# Altium schematic sheet 12 HEADERS.SchDoc
size 513 x 386 mm
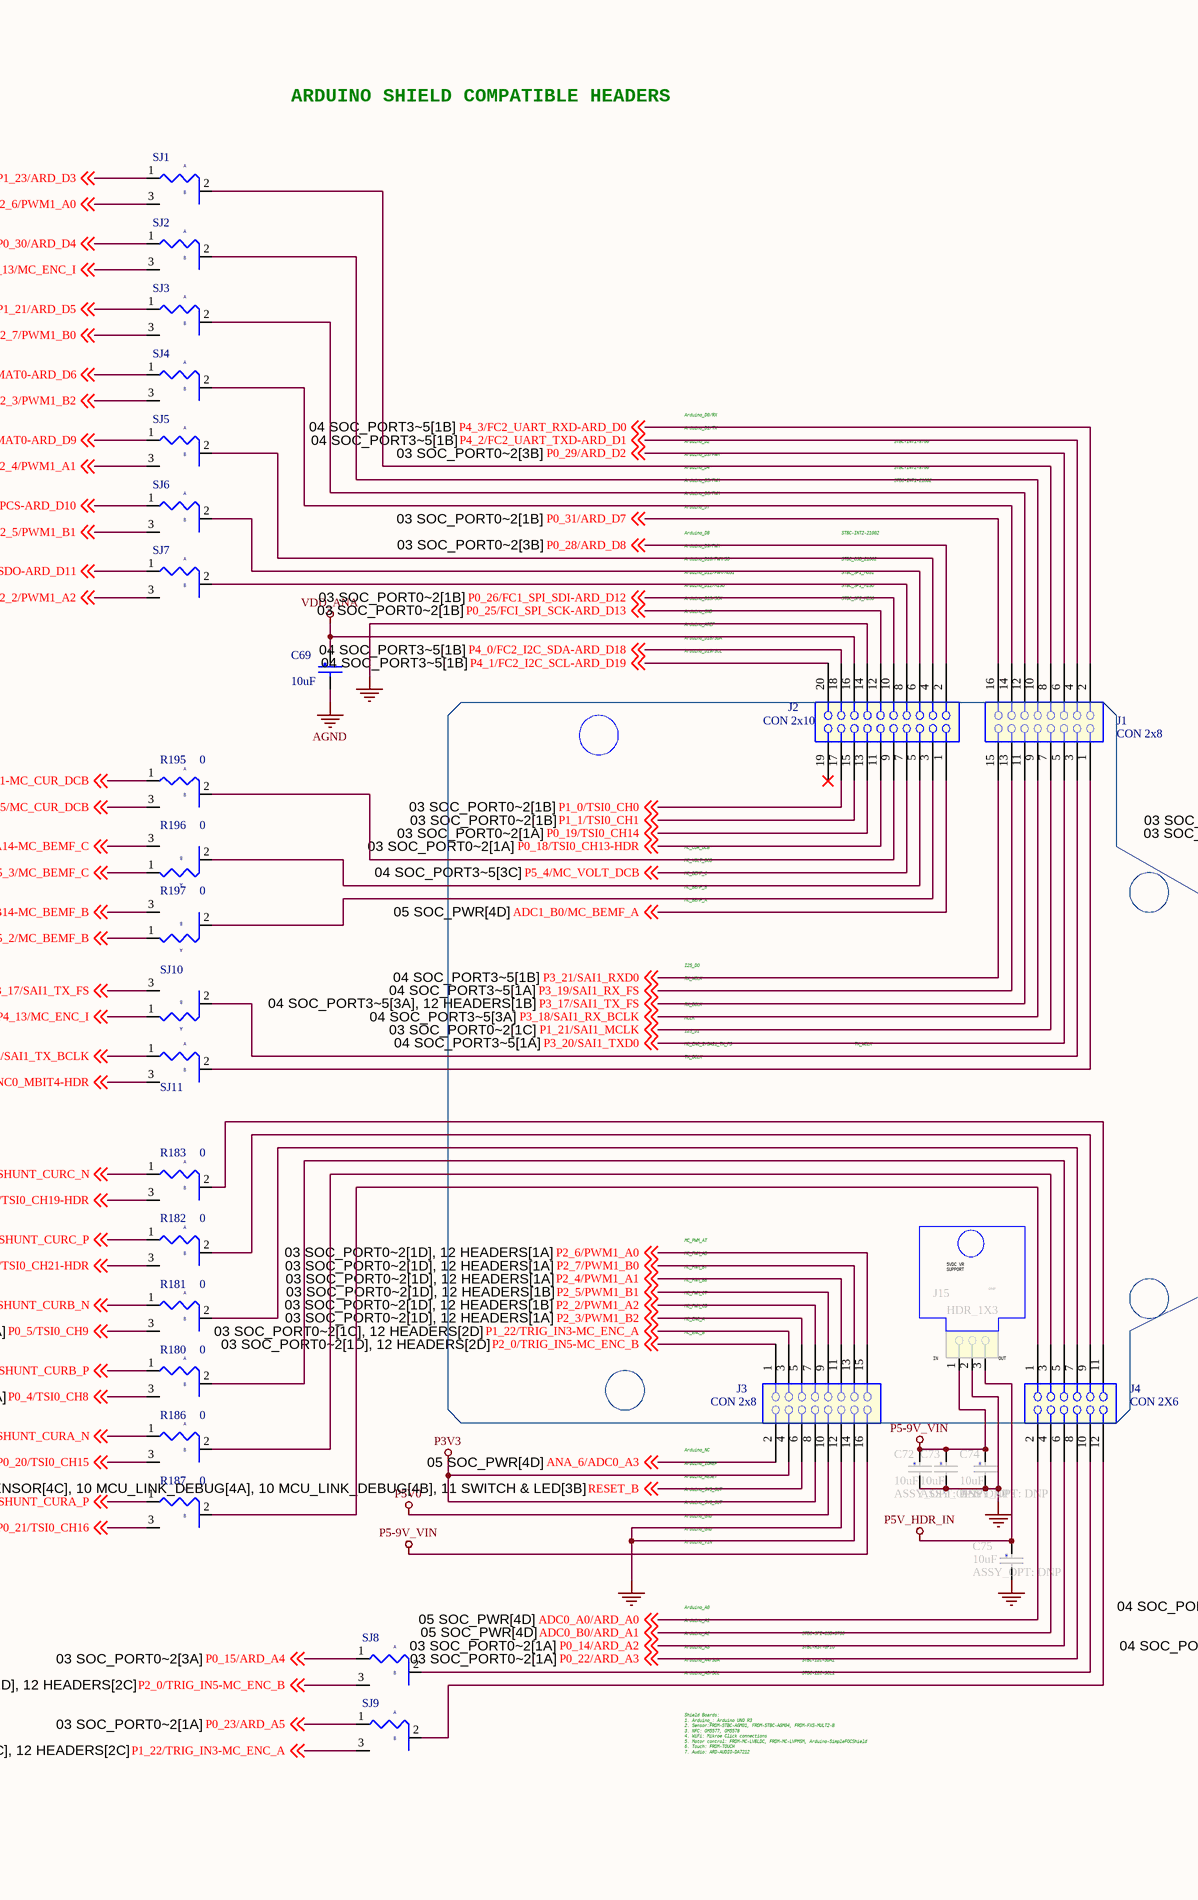
[diagram p0: 12 HEADERS.SchDoc, left]
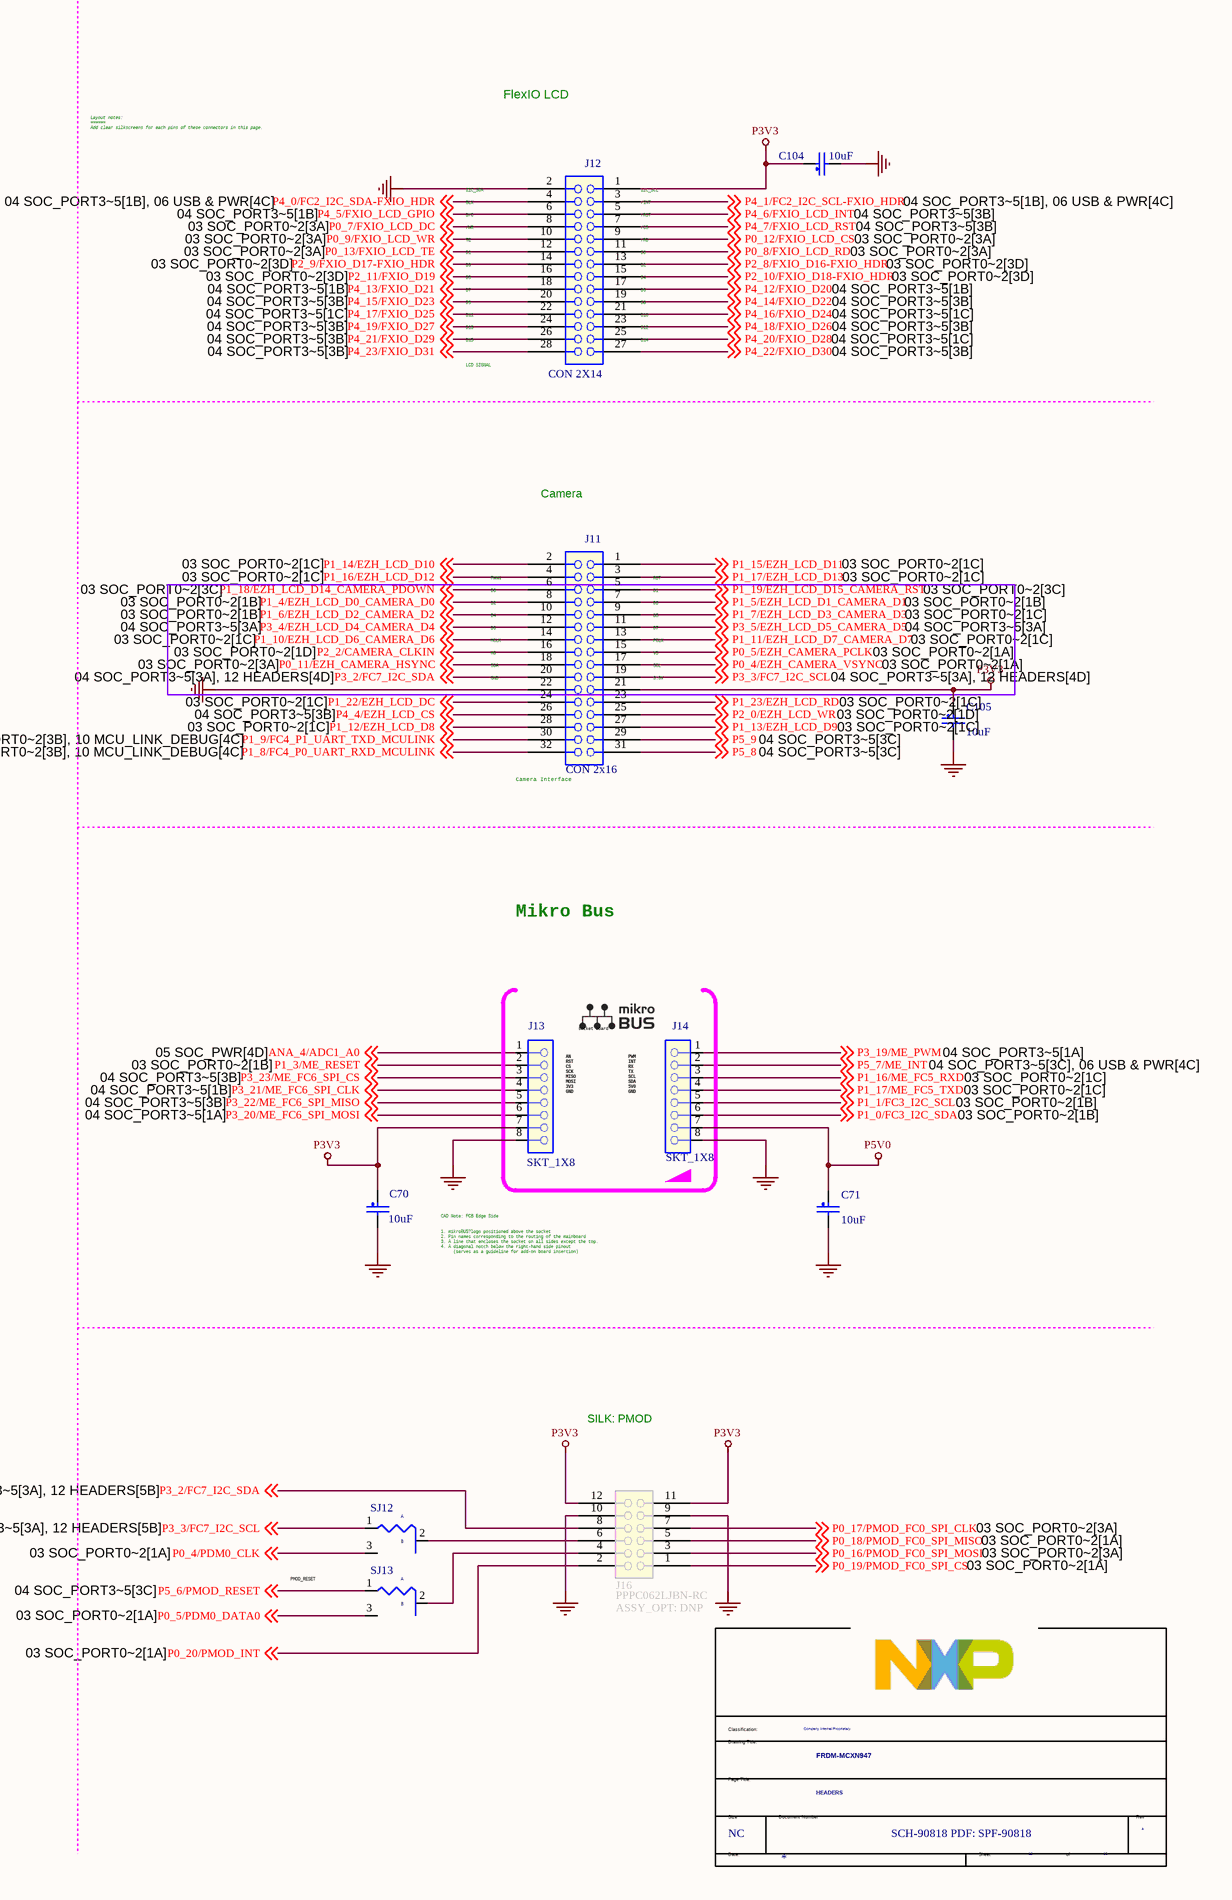
[diagram p1: 12 HEADERS.SchDoc, right]

## Parts
*  Doc: SCH-90818 PDF: SPF-90818  RevCode: A  Title: FRDM-MCXN947  Page Size: NC  Page Number: 12  Page Count: 13  PageTitle: HEADERS  Classification: Company Internal/Proprietary  (hidden comment: TitleBlock_FS)  (graphical)
C69  10uF  [CC0603_OV]
C70  10uF  [CC0603_OV]
C71  10uF  [CC0603_OV]
C72  10uF  ASSY_OPT: DNP  [CC0603_OV]
C73  10uF  ASSY_OPT: DNP  [CC0603_OV]
C74  10uF  ASSY_OPT: DNP  [CC0603_OV]
C75  10uF  ASSY_OPT: DNP  [CC0603_OV]
C104  10uF  [CC0603_OV]
C105  10uF  [CC0603_OV]
J1  CON 2x8  [con_2x8_skt_100_th]
J2  CON 2x10  [con_skt2x10_th]
J3  CON 2x8  [con_2x8_skt_100_th]
J4  CON 2X6  [con_skt2x6_th_126l]
J11  CON 2x16  SILK: Camera  [con_skt_32f_100_th]
J12  CON 2X14  SILK: FlexIO LCD  [con_skt2x14_th_126l]
J13  SKT_1X8  [con_1x8_skt_2p54_th_126l]
J14  SKT_1X8  [con_1x8_skt_2p54_th_126l]
J15  HDR_1X3  ASSY_OPT: DNP  [HDR103]
J16  PPPC062LJBN-RC  ASSY_OPT: DNP  SILK: PMOD  [skt2x6_100_th_ra]
R180  0  [R603-X2]
R181  0  [R603-X2]
R182  0  [R603-X2]
R183  0  [R603-X2]
R186  0  [R603-X2]
R187  0  [R603-X2]
R195  0  [R603-X2]
R196  0  [R603-X2]
R197  0  [R603-X2]
SJ1  3 PIN 0402 JUMPER  [3pin_0402_solder_blob_jumper_short_psp_a]  (value not drawn)
SJ2  3 PIN 0402 JUMPER  [3pin_0402_solder_blob_jumper_short_psp_a]  (value not drawn)
SJ3  3 PIN 0402 JUMPER  [3pin_0402_solder_blob_jumper_short_psp_a]  (value not drawn)
SJ4  3 PIN 0402 JUMPER  [3pin_0402_solder_blob_jumper_short_psp_a]  (value not drawn)
SJ5  3 PIN 0402 JUMPER  [3pin_0402_solder_blob_jumper_short_psp_a]  (value not drawn)
SJ6  3 PIN 0402 JUMPER  [3pin_0402_solder_blob_jumper_short_psp_a]  (value not drawn)
SJ7  3 PIN 0402 JUMPER  [3pin_0402_solder_blob_jumper_short_psp_a]  (value not drawn)
SJ8  3 PIN 0402 JUMPER  [3pin_0402_solder_blob_jumper_short_psp_a]  (value not drawn)
SJ9  3 PIN 0402 JUMPER  [3pin_0402_solder_blob_jumper_short_psp_a]  (value not drawn)
SJ10  3 PIN 0402 JUMPER  [3pin_0402_solder_blob_jumper_short_psp_a]  (value not drawn)
SJ11  3 PIN 0402 JUMPER  [3pin_0402_solder_blob_jumper_short_psp_a]  (value not drawn)
SJ12  3 PIN 0402 JUMPER  [3pin_0402_solder_blob_jumper_short_psp_a]  (value not drawn)
SJ13  3 PIN 0402 JUMPER  [3pin_0402_solder_blob_jumper_short_psp_a]  (value not drawn)

## Nets
AGND: C69.2
GND: C70.2 C71.2 C72.2 C73.2 C74.2 C75.2 C104.2 C105.2 J2.14 J3.12(B6) J3.14(B7) J11.22(B11) J12.2(B1) J13.8 J14.8 J15.2 J16.9(A5) J16.10(B5)
P3V3: C70.1 C104.1 C105.1 J3.4(B2) J3.8(B4) J11.21(A11) J12.1(A1) J13.7 J16.11(A6) J16.12(B6)
P5-9V_VIN: C72.1 C73.1 C74.1 J3.16(B8) J15.1
P5V0: C71.1 J3.10(B5) J14.7
P5V_HDR_IN: C75.1 J15.3
VDD_ANA: C69.1 J2.16
ADC0_A0/ARD_A0: J4.2(B1) ; off-sheet ADC0_A0/ARD_A0
ADC0_B0/ARD_A1: J4.4(B2) ; off-sheet ADC0_B0/ARD_A1
ADC1_B0/MC_BEMF_A: J2.1 ; off-sheet ADC1_B0/MC_BEMF_A
ANA_4/ADC1_A0: J13.1 ; off-sheet ANA_4/ADC1_A0
ANA_6/ADC0_A3: J3.2(B1) ; off-sheet ANA_6/ADC0_A3
OPAMP0_INN/RSHUNT_CURA_N: R186.1 ; off-sheet OPAMP0_INN/RSHUNT_CURA_N
OPAMP1_INN/RSHUNT_CURB_N: R181.1 ; off-sheet OPAMP1_INN/RSHUNT_CURB_N
OPAMP2_INN/RSHUNT_CURC_N: R183.1 ; off-sheet OPAMP2_INN/RSHUNT_CURC_N
P0_3/CMP1_IN1-MC_CUR_DCB: R195.1 ; off-sheet P0_3/CMP1_IN1-MC_CUR_DCB
P0_4/EZH_CAMERA_VSYNC: J11.17(A9) ; off-sheet P0_4/EZH_CAMERA_VSYNC
P0_4/PDM0_CLK: SJ12.3 ; off-sheet P0_4/PDM0_CLK
P0_4/TSI0_CH8: R180.3 ; off-sheet P0_4/TSI0_CH8
P0_5/EZH_CAMERA_PCLK: J11.15(A8) ; off-sheet P0_5/EZH_CAMERA_PCLK
P0_5/PDM0_DATA0: SJ13.3 ; off-sheet P0_5/PDM0_DATA0
P0_5/TSI0_CH9: R181.3 ; off-sheet P0_5/TSI0_CH9
P0_7/FXIO_LCD_DC: J12.8(B4) ; off-sheet P0_7/FXIO_LCD_DC
P0_8/FXIO_LCD_RD: J12.11(A6) ; off-sheet P0_8/FXIO_LCD_RD
P0_9/FXIO_LCD_WR: J12.10(B5) ; off-sheet P0_9/FXIO_LCD_WR
P0_10/CT0_MAT0-ARD_D9: SJ5.1 ; off-sheet P0_10/CT0_MAT0-ARD_D9
P0_11/EZH_CAMERA_HSYNC: J11.18(B9) ; off-sheet P0_11/EZH_CAMERA_HSYNC
P0_12/FXIO_LCD_CS: J12.9(A5) ; off-sheet P0_12/FXIO_LCD_CS
P0_13/FXIO_LCD_TE: J12.12(B6) ; off-sheet P0_13/FXIO_LCD_TE
P0_14/ADC0_B14-MC_BEMF_B: R197.3 ; off-sheet P0_14/ADC0_B14-MC_BEMF_B
P0_14/ARD_A2: J4.6(B3) ; off-sheet P0_14/ARD_A2
P0_15/ARD_A4: SJ8.1 ; off-sheet P0_15/ARD_A4
P0_16/PMOD_FC0_SPI_MOSI: J16.3(A2) ; off-sheet P0_16/PMOD_FC0_SPI_MOSI
P0_17/PMOD_FC0_SPI_CLK: J16.7(A4) ; off-sheet P0_17/PMOD_FC0_SPI_CLK
P0_18/PMOD_FC0_SPI_MISO: J16.5(A3) ; off-sheet P0_18/PMOD_FC0_SPI_MISO
P0_18/TSI0_CH13-HDR: J2.11 ; off-sheet P0_18/TSI0_CH13-HDR
P0_19/PMOD_FC0_SPI_CS: J16.1(A1) ; off-sheet P0_19/PMOD_FC0_SPI_CS
P0_19/TSI0_CH14: J2.13 ; off-sheet P0_19/TSI0_CH14
P0_20/PMOD_INT: J16.2(B1) ; off-sheet P0_20/PMOD_INT
P0_20/TSI0_CH15: R186.3 ; off-sheet P0_20/TSI0_CH15
P0_21/TSI0_CH16: R187.3 ; off-sheet P0_21/TSI0_CH16
P0_22/ADC0_A14-MC_BEMF_C: R196.3 ; off-sheet P0_22/ADC0_A14-MC_BEMF_C
P0_22/ARD_A3: J4.8(B4) ; off-sheet P0_22/ARD_A3
P0_23/ARD_A5: SJ9.1 ; off-sheet P0_23/ARD_A5
P0_24/FC1_SPI_SDO-ARD_D11: SJ7.1 ; off-sheet P0_24/FC1_SPI_SDO-ARD_D11
P0_25/FCI_SPI_SCK-ARD_D13: J2.12 ; off-sheet P0_25/FCI_SPI_SCK-ARD_D13
P0_26/FC1_SPI_SDI-ARD_D12: J2.10 ; off-sheet P0_26/FC1_SPI_SDI-ARD_D12
P0_27/FC1_SPI_PCS-ARD_D10: SJ6.1 ; off-sheet P0_27/FC1_SPI_PCS-ARD_D10
P0_28/ARD_D8: J2.2 ; off-sheet P0_28/ARD_D8
P0_29/ARD_D2: J1.6(B3) ; off-sheet P0_29/ARD_D2
P0_30/ARD_D4: SJ2.1 ; off-sheet P0_30/ARD_D4
P0_31/ARD_D7: J1.16(B8) ; off-sheet P0_31/ARD_D7
P1_0/FC3_I2C_SDA: J14.6 ; off-sheet P1_0/FC3_I2C_SDA
P1_0/TSI0_CH0: J2.17 ; off-sheet P1_0/TSI0_CH0
P1_1/FC3_I2C_SCL: J14.5 ; off-sheet P1_1/FC3_I2C_SCL
P1_1/TSI0_CH1: J2.15 ; off-sheet P1_1/TSI0_CH1
P1_2/CT1_MAT0-ARD_D6: SJ4.1 ; off-sheet P1_2/CT1_MAT0-ARD_D6
P1_3/ME_RESET: J13.2 ; off-sheet P1_3/ME_RESET
P1_4/EZH_LCD_D0_CAMERA_D0: J11.8(B4) ; off-sheet P1_4/EZH_LCD_D0_CAMERA_D0
P1_5/EZH_LCD_D1_CAMERA_D1: J11.7(A4) ; off-sheet P1_5/EZH_LCD_D1_CAMERA_D1
P1_6/EZH_LCD_D2_CAMERA_D2: J11.10(B5) ; off-sheet P1_6/EZH_LCD_D2_CAMERA_D2
P1_7/EZH_LCD_D3_CAMERA_D3: J11.9(A5) ; off-sheet P1_7/EZH_LCD_D3_CAMERA_D3
P1_8/FC4_P0_UART_RXD_MCULINK: J11.32(B16) ; off-sheet P1_8/FC4_P0_UART_RXD_MCULINK
P1_9/FC4_P1_UART_TXD_MCULINK: J11.30(B15) ; off-sheet P1_9/FC4_P1_UART_TXD_MCULINK
P1_10/EZH_LCD_D6_CAMERA_D6: J11.14(B7) ; off-sheet P1_10/EZH_LCD_D6_CAMERA_D6
P1_10/TSI0_CH19-HDR: R183.3 ; off-sheet P1_10/TSI0_CH19-HDR
P1_11/EZH_LCD_D7_CAMERA_D7: J11.13(A7) ; off-sheet P1_11/EZH_LCD_D7_CAMERA_D7
P1_12/EZH_LCD_D8: J11.28(B14) ; off-sheet P1_12/EZH_LCD_D8
P1_12/TSI0_CH21-HDR: R182.3 ; off-sheet P1_12/TSI0_CH21-HDR
P1_13/EZH_LCD_D9: J11.27(A14) ; off-sheet P1_13/EZH_LCD_D9
P1_14/EZH_LCD_D10: J11.2(B1) ; off-sheet P1_14/EZH_LCD_D10
P1_15/EZH_LCD_D11: J11.1(A1) ; off-sheet P1_15/EZH_LCD_D11
P1_16/EZH_LCD_D12: J11.4(B2) ; off-sheet P1_16/EZH_LCD_D12
P1_16/ME_FC5_RXD: J14.3 ; off-sheet P1_16/ME_FC5_RXD
P1_17/EZH_LCD_D13: J11.3(A2) ; off-sheet P1_17/EZH_LCD_D13
P1_17/ME_FC5_TXD: J14.4 ; off-sheet P1_17/ME_FC5_TXD
P1_18/EZH_LCD_D14_CAMERA_PDOWN: J11.6(B3) ; off-sheet P1_18/EZH_LCD_D14_CAMERA_PDOWN
P1_19/EZH_LCD_D15_CAMERA_RST: J11.5(A3) ; off-sheet P1_19/EZH_LCD_D15_CAMERA_RST
P1_21/ARD_D5: SJ3.1 ; off-sheet P1_21/ARD_D5
P1_21/SAI1_MCLK: J1.7(A4) ; off-sheet P1_21/SAI1_MCLK
P1_22/EZH_LCD_DC: J11.24(B12) ; off-sheet P1_22/EZH_LCD_DC
P1_22/TRIG_IN3-MC_ENC_A: J3.3(A2) SJ9.3 ; off-sheet P1_22/TRIG_IN3-MC_ENC_A
P1_23/ARD_D3: SJ1.1 ; off-sheet P1_23/ARD_D3
P1_23/EZH_LCD_RD: J11.23(A12) ; off-sheet P1_23/EZH_LCD_RD
P2_0/EZH_LCD_WR: J11.25(A13) ; off-sheet P2_0/EZH_LCD_WR
P2_0/TRIG_IN5-MC_ENC_B: J3.1(A1) SJ8.3 ; off-sheet P2_0/TRIG_IN5-MC_ENC_B
P2_2/CAMERA_CLKIN: J11.16(B8) ; off-sheet P2_2/CAMERA_CLKIN
P2_2/PWM1_A2: J3.7(A4) SJ7.3 ; off-sheet P2_2/PWM1_A2
P2_3/PWM1_B2: J3.5(A3) SJ4.3 ; off-sheet P2_3/PWM1_B2
P2_4/PWM1_A1: J3.11(A6) SJ5.3 ; off-sheet P2_4/PWM1_A1
P2_5/PWM1_B1: J3.9(A5) SJ6.3 ; off-sheet P2_5/PWM1_B1
P2_6/PWM1_A0: J3.15(A8) SJ1.3 ; off-sheet P2_6/PWM1_A0
P2_7/PWM1_B0: J3.13(A7) SJ3.3 ; off-sheet P2_7/PWM1_B0
P2_8/FXIO_D16-FXIO_HDR: J12.13(A7) ; off-sheet P2_8/FXIO_D16-FXIO_HDR
P2_9/FXIO_D17-FXIO_HDR: J12.14(B7) ; off-sheet P2_9/FXIO_D17-FXIO_HDR
P2_10/FXIO_D18-FXIO_HDR: J12.15(A8) ; off-sheet P2_10/FXIO_D18-FXIO_HDR
P2_11/FXIO_D19: J12.16(B8) ; off-sheet P2_11/FXIO_D19
P3_2/FC7_I2C_SDA: J11.20(B10) J16.8(B4) ; off-sheet P3_2/FC7_I2C_SDA
P3_3/FC7_I2C_SCL: J11.19(A10) SJ12.1 ; off-sheet P3_3/FC7_I2C_SCL
P3_4/EZH_LCD_D4_CAMERA_D4: J11.12(B6) ; off-sheet P3_4/EZH_LCD_D4_CAMERA_D4
P3_5/EZH_LCD_D5_CAMERA_D5: J11.11(A6) ; off-sheet P3_5/EZH_LCD_D5_CAMERA_D5
P3_16/SAI1_TX_BCLK: SJ11.1 ; off-sheet P3_16/SAI1_TX_BCLK
P3_17/SAI1_TX_FS: J1.11(A6) SJ10.3 ; off-sheet P3_17/SAI1_TX_FS
P3_18/SAI1_RX_BCLK: J1.9(A5) ; off-sheet P3_18/SAI1_RX_BCLK
P3_19/ME_PWM: J14.1 ; off-sheet P3_19/ME_PWM
P3_19/SAI1_RX_FS: J1.13(A7) ; off-sheet P3_19/SAI1_RX_FS
P3_20/ME_FC6_SPI_MOSI: J13.6 ; off-sheet P3_20/ME_FC6_SPI_MOSI
P3_20/SAI1_TXD0: J1.5(A3) ; off-sheet P3_20/SAI1_TXD0
P3_21/ME_FC6_SPI_CLK: J13.4 ; off-sheet P3_21/ME_FC6_SPI_CLK
P3_21/SAI1_RXD0: J1.15(A8) ; off-sheet P3_21/SAI1_RXD0
P3_22/ME_FC6_SPI_MISO: J13.5 ; off-sheet P3_22/ME_FC6_SPI_MISO
P3_23/ME_FC6_SPI_CS: J13.3 ; off-sheet P3_23/ME_FC6_SPI_CS
P4_0/FC2_I2C_SDA-ARD_D18: J2.18 ; off-sheet P4_0/FC2_I2C_SDA-ARD_D18
P4_0/FC2_I2C_SDA-FXIO_HDR: J12.4(B2) ; off-sheet P4_0/FC2_I2C_SDA-FXIO_HDR
P4_1/FC2_I2C_SCL-ARD_D19: J2.20 ; off-sheet P4_1/FC2_I2C_SCL-ARD_D19
P4_1/FC2_I2C_SCL-FXIO_HDR: J12.3(A2) ; off-sheet P4_1/FC2_I2C_SCL-FXIO_HDR
P4_2/FC2_UART_TXD-ARD_D1: J1.4(B2) ; off-sheet P4_2/FC2_UART_TXD-ARD_D1
P4_3/FC2_UART_RXD-ARD_D0: J1.2(B1) ; off-sheet P4_3/FC2_UART_RXD-ARD_D0
P4_4/EZH_LCD_CS: J11.26(B13) ; off-sheet P4_4/EZH_LCD_CS
P4_5/FXIO_LCD_GPIO: J12.6(B3) ; off-sheet P4_5/FXIO_LCD_GPIO
P4_5/SINC0_MBIT4-HDR: SJ11.3 ; off-sheet P4_5/SINC0_MBIT4-HDR
P4_6/FXIO_LCD_INT: J12.5(A3) ; off-sheet P4_6/FXIO_LCD_INT
P4_7/FXIO_LCD_RST: J12.7(A4) ; off-sheet P4_7/FXIO_LCD_RST
P4_12/FXIO_D20: J12.17(A9) ; off-sheet P4_12/FXIO_D20
P4_12/RSHUNT_CURA_P: R187.1 ; off-sheet P4_12/RSHUNT_CURA_P
P4_13/FXIO_D21: J12.18(B9) ; off-sheet P4_13/FXIO_D21
P4_13/MC_ENC_I: SJ2.3 SJ10.1 ; off-sheet P4_13/MC_ENC_I
P4_14/FXIO_D22: J12.19(A10) ; off-sheet P4_14/FXIO_D22
P4_15/FXIO_D23: J12.20(B10) ; off-sheet P4_15/FXIO_D23
P4_16/FXIO_D24: J12.21(A11) ; off-sheet P4_16/FXIO_D24
P4_16/RSHUNT_CURB_P: R180.1 ; off-sheet P4_16/RSHUNT_CURB_P
P4_17/FXIO_D25: J12.22(B11) ; off-sheet P4_17/FXIO_D25
P4_18/FXIO_D26: J12.23(A12) ; off-sheet P4_18/FXIO_D26
P4_19/FXIO_D27: J12.24(B12) ; off-sheet P4_19/FXIO_D27
P4_20/FXIO_D28: J12.25(A13) ; off-sheet P4_20/FXIO_D28
P4_20/RSHUNT_CURC_P: R182.1 ; off-sheet P4_20/RSHUNT_CURC_P
P4_21/FXIO_D29: J12.26(B13) ; off-sheet P4_21/FXIO_D29
P4_22/FXIO_D30: J12.27(A14) ; off-sheet P4_22/FXIO_D30
P4_23/FXIO_D31: J12.28(B14) ; off-sheet P4_23/FXIO_D31
P5_2/MC_BEMF_B: R197.1 ; off-sheet P5_2/MC_BEMF_B
P5_3/MC_BEMF_C: R196.1 ; off-sheet P5_3/MC_BEMF_C
P5_4/MC_VOLT_DCB: J2.7 ; off-sheet P5_4/MC_VOLT_DCB
P5_5/MC_CUR_DCB: R195.3 ; off-sheet P5_5/MC_CUR_DCB
P5_6/PMOD_RESET: SJ13.1 ; off-sheet P5_6/PMOD_RESET
P5_7/ME_INT: J14.2 ; off-sheet P5_7/ME_INT
P5_8: J11.31(A16) ; off-sheet P5_8
P5_9: J11.29(A15) ; off-sheet P5_9
RESET_B: J3.6(B3) ; off-sheet RESET_B
NetJ1_1: J1.1(A1) SJ11.2
NetJ1_3: J1.3(A2) SJ10.2
NetJ1_8: J1.8(B4) SJ1.2
NetJ1_10: J1.10(B5) SJ2.2
NetJ1_12: J1.12(B6) SJ3.2
NetJ1_14: J1.14(B7) SJ4.2
NetJ2_3: J2.3 R197.2
NetJ2_4: J2.4 SJ5.2
NetJ2_5: J2.5 R196.2
NetJ2_6: J2.6 SJ6.2
NetJ2_8: J2.8 SJ7.2
NetJ2_9: J2.9 R195.2
NetJ4_1: J4.1(A1) R187.2
NetJ4_3: J4.3(A2) R186.2
NetJ4_5: J4.5(A3) R180.2
NetJ4_7: J4.7(A4) R181.2
NetJ4_9: J4.9(A5) R182.2
NetJ4_10: J4.10(B5) SJ8.2
NetJ4_11: J4.11(A6) R183.2
NetJ4_12: J4.12(B6) SJ9.2
NetJ16_4: J16.4(B2) SJ13.2
NetJ16_6: J16.6(B3) SJ12.2

Not connected (* = marked no-connect by the designer): J2 19*

## Notes on the sheet
- ARDUINO SHIELD COMPATIBLE HEADERS
- Layout notes:
  ======
  Add clear silkscreens for each pins of these connectors in this page.
- D/C
- BLK
- I2C_SDA
- (near J12) /RST
- (near J12) I2C_SCL
- (near J12) /INT
- TE
- D1
- D5
- /WR
- D3
- (near J12) /RD
- (near J12) D2
- (near J12) D4
- (near J12) /CS
- (near J12) D0
- D11
- D13
- D7
- D9
- D15
- (near J12) D6
- (near J12) D10
- (near J12) D14
- (near J12) D12
- (near J12) D8
- Arduino_D3/PWM
- Arduino_D2
- Arduino_D1/TX
- Arduino_D4
- Arduino_D0/RX
- STBC-INT2-8700
- STBC-INT1-8700
- LCD SIGNAL
- Arduino_D6/PWM
- Arduino_D7
- Arduino_D8
- Arduino_D5/PWM
- STBC-INT2-21002
- STBC-INT1-21002
- Arduino_D10/PWM/SS
- Arduino_D12/MISO
- Arduino_D11/PWM/MOSI
- Arduino_D9/PWM
- Arduino_D13/SCK
- STBC_SPI_MOSI
- STBC_SPI_MISO
- STBC_CSB_21002
- Arduino_D19/SCL
- Arduino_D18/SDA
- Arduino_AREF
- Arduino_GND
- PWNN
- D0
- RST
- HS
- MCLK
- D2
- D4
- D6
- VS
- PCLK
- GND
- SDA
- 3.3V
- SCL
- MC_VOLT_DCB
- MC_CUR_DCB
- (near J11) Camera Interface
- MC_BEMF_A
- MC_BEMF_B
- MC_BEMF_C
- I2S_DO
- RX_WCLK
- MC_ENC_I/SAI1_TX_FS
- RX_BCLK
- I2S_DI
- TX_BCLK
- TX_WCLK
- Mikro Bus
- socket board
- MC_PWM_AB
- MC_PWM_AT
- (near J13) AN
  RST
  CS
  SCK
  MISO
  MOSI
  3V3
  GND
- (near J14) PWM
  INT
  RX
  TX
  SCL
  SDA
  5V0
  GND
- MC_PWM_BT
- MC_PWM_BB
- MC_PWM_CB
- MC_PWM_CT
- MC_ENC_A
- 5VDC VR
  SUPPORT
- CAD Note: PCB Edge Side
- MC_ENC_B
- (near J15) IN
- (near J15) OUT
- (near C71) 1. mikroBUS?logo positioned above the socket
  2. Pin names corresponding to the routing of the mainboard
  3. A line that encloses the socket on all sides except the top.
  4. A diagonal notch below the right-hand side pinout
  (serves as a guideline for add-on board insertion)
- Arduino_NC
- Arduino_3V3_OUT
- Arduino_IOREF
- Arduino_RESET
- Arduino_5V0_OUT
- Arduino_VIN
- Arduino_A3
- Arduino_A2
- Arduino_A0
- Arduino_A1
- STBC-SPI-CSB-8700
- STBC-RST-GPIO
- Arduino_A4/SDA
- Arduino_A5/SCL
- STBC-I2C-SDA1
- STBC-I2C-SCL1
- PMOD_RESET
- Shield Boards:
  1. Arduino_: Arduino UNO R3
  2. Sensor:FRDM-STBC-AGM01, FRDM-STBC-AGM04, FRDM-FXS-MULT2-B
  3. NFC: OM5577, OM5578
  4. WiFi: Mikroe Click connections
  5. Motor control: FRDM-MC-LVBLDC, FRDM-MC-LVPMSM, Arduino-SimpleFOCShield
  6. Touch: FRDM-TOUCH
  7. Audio: ARD-AUDIO-DA7212
- (in symbol RES_3PIN) A; B
- (in symbol TitleBlock_FS) Classification:; Drawing Title:; Page Title:; Size; Document Number; Rev; Date:; Sheet; of

## Library data of the parts
* = TitleBlock_FS: Classification: Public, Company Internal/Proprietary, Company Confidential,  Company Secret; OrgName: NXP Semiconductors; OrgAddr1: 6501 William Cannon Drive West; OrgAddr2: Austin, TX 78735-8598; Variant Name: <Core Design>; Page Create Date: March  8, 1995; Page Modify Date: *
C69-C71 C73 C104 C105 = CAP_NP: CAP CER 10uF 25V 10% X5R 0603; CLASS: DISCRETE; MFG_PN01: C0603X5R106K250NT; MFG_NAME01: SANYEAR; CAD_APPROVED: Yes; AGILE_PN: 150-79569; PCB Footprint: CC0603_OV; 3D_Mechanical_Footprint_File: http://fcl.am.freescale.net/ALLEGRO/step/cc0603_ov.STEP; ROHS: Yes; Rated Voltage: 25V; Tolerance: 10%; Package Type: SMD/SMT; HEIGHT: 1MM; Package Size: 0603 [1608 Metric]
C72 C74 C75 = CAP_NP: CAP CER 10uF 25V 10% X5R 0603; CLASS: DISCRETE; AGILE_PN: 150-79569; CAD_APPROVED: Yes; MFG_NAME01: SANYEAR; MFG_PN01: C0603X5R106K250NT; PCB Footprint: CC0603_OV; Package Size: 0603 [1608 Metric]; HEIGHT: 1MM; Package Type: SMD/SMT; Tolerance: 10%; Rated Voltage: 25V; ROHS: Yes; 3D_Mechanical_Footprint_File: http://fcl.am.freescale.net/ALLEGRO/step/cc0603_ov.STEP
J1 J3 = CONN_HDR_8X2: CON 2X8 SKT SHRD TH 100MIL CTR 345H AU 126L; CLASS: IO; AGILE_PN: 210-81775; CAD_APPROVED: Yes; Temp Range: -40 to +105C; MFG_NAME01: ANYTRONIC CORPORATION LIMITED; MFG_PN01: 08010S31611-29RF; PCB Footprint: con_2x8_skt_100_th; HEIGHT: 8.75MM; ROHS: Yes; 3D_Mechanical_Footprint_File: http://fcl.am.freescale.net/ALLEGRO/step/con_2x8_skt_100_th.STEP
J2 = CONN_HDR_10X2: CON 2X10 SKT SHRD TH 100MIL CTR 345H AU 126L; CLASS: IO; MFG_PN01: 08010S32011-29RF; MFG_NAME01: ANYTRONIC CORPORATION LIMITED; Temp Range: -40 to +105C; CAD_APPROVED: Yes; AGILE_PN: 210-81776; PCB Footprint: con_skt2x10_th; 3D_Mechanical_Footprint_File: http://fcl.am.freescale.net/ALLEGRO/step/con_skt2x10_th.STEP; ROHS: Yes; HEIGHT: 8.75MM
J4 = CONN_HDR_6X2: CON 2X6 SKT SHRD TH 100MIL CTR 345H AU 126L; CLASS: IO; MFG_PN01: 08010S31211-29RF; MFG_NAME01: ANYTRONIC CORPORATION LIMITED; Temp Range: -40 to +105C; CAD_APPROVED: Yes; FPLIST: con_skt2x6_th_126l,con_skt2x6_th; AGILE_PN: 210-81774; PCB Footprint: con_skt2x6_th_126l; 3D_Mechanical_Footprint_File: http://fcl.am.freescale.net/ALLEGRO/step/con_skt2x6_th_126l.STEP; ROHS: Yes; HEIGHT: 8.75MM
J11 = CONN_HDR_16X2: CON 2X16 SKT SHRD TH 100MIL CTR 345H AU 126L; CLASS: IO; AGILE_PN: 210-83440; CAD_APPROVED: Yes; Temp Range: -40 to +105C; MFG_NAME01: ANYTRONIC CORPORATION LIMITED; MFG_PN01: 08010S33211-29RF; HEIGHT: 8.75MM; ROHS: Yes; PCB Footprint: con_skt_32f_100_th
J12 = CONN_HDR_14X2: CON 2X14 SKT SHRD TH 100MIL CTR 345H AU 126L; CLASS: IO; AGILE_PN: 210-83442; CAD_APPROVED: Yes; Temp Range: -40 to +105C; MFG_NAME01: ANYTRONIC CORPORATION LIMITED; MFG_PN01: 08010S32811-29RF; HEIGHT: 8.75MM; ROHS: Yes; 3D_Mechanical_Footprint_File: http://fcl.am.freescale.net/ALLEGRO/step/con_skt2x14_th_126l.STEP; PCB Footprint: con_skt2x14_th_126l
J13 J14 = CONN_HDR_8X1: CON 1X8 SKT TH 100MIL SP 344H AU 118L; CLASS: IO; MFG_PN01: 08001S3 0811-29RF; MFG_NAME01: ANYTRONIC CORPORATION LIMITED; Temp Range: -40¡ãC to +105¡ãC; CAD_APPROVED: Yes; FPLIST: con_1x8_skt_2p54_th_126l,con_1x8_skt_2p54_th; AGILE_PN: 210-81617; 3D_Mechanical_Footprint_File: http://fcl.am.freescale.net/ALLEGRO/step/con_1x8_skt_2p54_th_126l.STEP; ROHS: Yes; HEIGHT: 8.75MM; PCB Footprint: con_1x8_skt_2p54_th_126l
J15 = CONN_HDR_3X1: HDR 1X3 TH 100MIL SP 330H AU 98L; CLASS: IO; PRIORITY_PN: 028-00700; AGILE_PN: 210-75442; MFG_NAME01: SAMTEC; MFG_PN01: HTSW-103-07-S-S; CAD_APPROVED: Yes; Temp Range: -55¡ãC to +125¡ãC; PCB Footprint: HDR103; 3D_Mechanical_Footprint_File: http://fcl.am.freescale.net/ALLEGRO/step/hdr103_330h.STEP; ROHS: Yes; HEIGHT: 8.59MM; Package Type: HEADER
J16 = CONN_HDR_6X2: CON 2X6 SKT RA TH 100MIL CTR 206H AU 124L; CLASS: IO; MFG_NAME01: SULLINS ELECTRONICS CORP; CAD_APPROVED: Yes; AGILE_PN: 210-80998; 3D_Mechanical_Footprint_File: http://fcl.am.freescale.net/ALLEGRO/step/skt2x6_100_th_ra.step; MFG_PN01: PPPC062LJBN-RC; ROHS: Yes; HEIGHT: 5.28 MM; PCB Footprint: skt2x6_100_th_ra
R180 R181 R183 R195 = RES_3PIN: RES MF ZERO OHM 1/10W -- 0603; CLASS: DISCRETE; MFG_PN01: RC0603FR-070RL; MFG_NAME01: YAGEO AMERICA; Temp Range: ¨C55 ¡ãC to +155 ¡ãC; CAD_APPROVED: Yes; FPLIST: RC0603_OV,RC0603,R603-X2,r603-x2_b,0603_CC,IND_0603HP_NSP,CC0603_OV_NSP; AGILE_PN: 470-80866; PCB Footprint: R603-X2; ROHS: Yes; HEIGHT: 0.6MM
R182 R186 R187 R196 R197 = RES_3PIN: RES MF ZERO OHM 1/10W -- 0603; CLASS: DISCRETE; AGILE_PN: 470-80866; FPLIST: RC0603_OV,RC0603,R603-X2,r603-x2_b,0603_CC,IND_0603HP_NSP,CC0603_OV_NSP; CAD_APPROVED: Yes; Temp Range: ¨C55 ¡ãC to +155 ¡ãC; MFG_NAME01: YAGEO AMERICA; MFG_PN01: RC0603FR-070RL; PCB Footprint: R603-X2; HEIGHT: 0.6MM; ROHS: Yes
SJ1-SJ9 SJ11 SJ13 = RES_3PIN: SOLDER BLOB JUMPER 3PIN 1-2 SHORT 0402 - NO PART TO ORDER; CLASS: DISCRETE; AGILE_PN: 470-83095; FPLIST: 3pin_0402_solder_blob_jumper_short,3pin_0402_solder_blob_jumper_short_psp_a; CAD_APPROVED: Yes; MFG_NAME01: NA; MFG_PN01: NO PART ORDER,; PCB Footprint: 3pin_0402_solder_blob_jumper_short_psp_a; HEIGHT: 0.1016MM; ROHS: Yes; SHORT(DEFAULT): 1-2
SJ10 SJ12 = RES_3PIN: SOLDER BLOB JUMPER 3PIN 1-2 SHORT 0402 - NO PART TO ORDER; CLASS: DISCRETE; MFG_PN01: NO PART ORDER,; MFG_NAME01: NA; CAD_APPROVED: Yes; FPLIST: 3pin_0402_solder_blob_jumper_short,3pin_0402_solder_blob_jumper_short_psp_a; AGILE_PN: 470-83095; SHORT(DEFAULT): 1-2; ROHS: Yes; HEIGHT: 0.1016MM; PCB Footprint: 3pin_0402_solder_blob_jumper_short_psp_a